# EAGLE schematic Raspberry Pi Header (EAGLE 7.0.0)
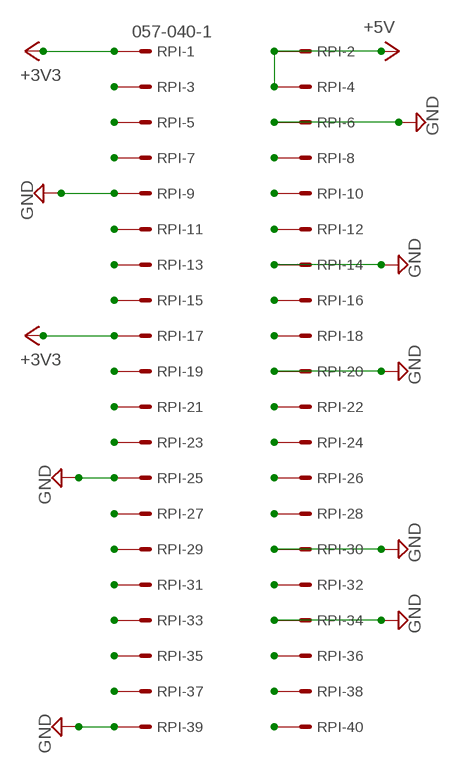
[diagram p0: schematic, sheet 1]

## Parts
RPI  057-040-1  [057-040-1]

## Nets
+3V3: RPI.1 RPI.17
+5V: RPI.2 RPI.4
GND: RPI.6 RPI.9 RPI.14 RPI.20 RPI.25 RPI.30 RPI.34 RPI.39
GPIO2(SDA): RPI.3
GPIO3(SCL): RPI.5
GPIO4(GPIO_GCLK): RPI.7
GPIO5: RPI.29
GPIO6: RPI.31
GPIO7(SPI_CE1_N): RPI.26
GPIO8(SPI_CE0_N): RPI.24
GPIO9(SPI_MISO): RPI.21
GPIO10(SPI_MOSI): RPI.19
GPIO11(SPI_SCLK): RPI.23
GPIO12: RPI.32
GPIO13: RPI.33
GPIO14(TXD0): RPI.8
GPIO15(RXD0): RPI.10
GPIO16: RPI.36
GPIO17(GPIO_GEN0): RPI.11
GPIO18(GPIO_GEN1): RPI.12
GPIO19: RPI.35
GPIO20: RPI.38
GPIO21: RPI.40
GPIO22(GPIO_GEN3): RPI.15
GPIO23(GPIO_GEN4): RPI.16
GPIO24(GPIO_GEN5): RPI.18
GPIO25(GPIO_GEN6): RPI.22
GPIO27(GPIO_GEN2): RPI.13
ID_SC: RPI.28
ID_SD: RPI.27
N$15: RPI.37

## Library data of the parts
RPI = con-panduit:057-040-: CONNECTOR 40-pin series 057 contact pc board low profile headers; OC_FARNELL: unknown; OC_NEWARK: unknown